# EAGLE design capMet (EAGLE 9.6.1)
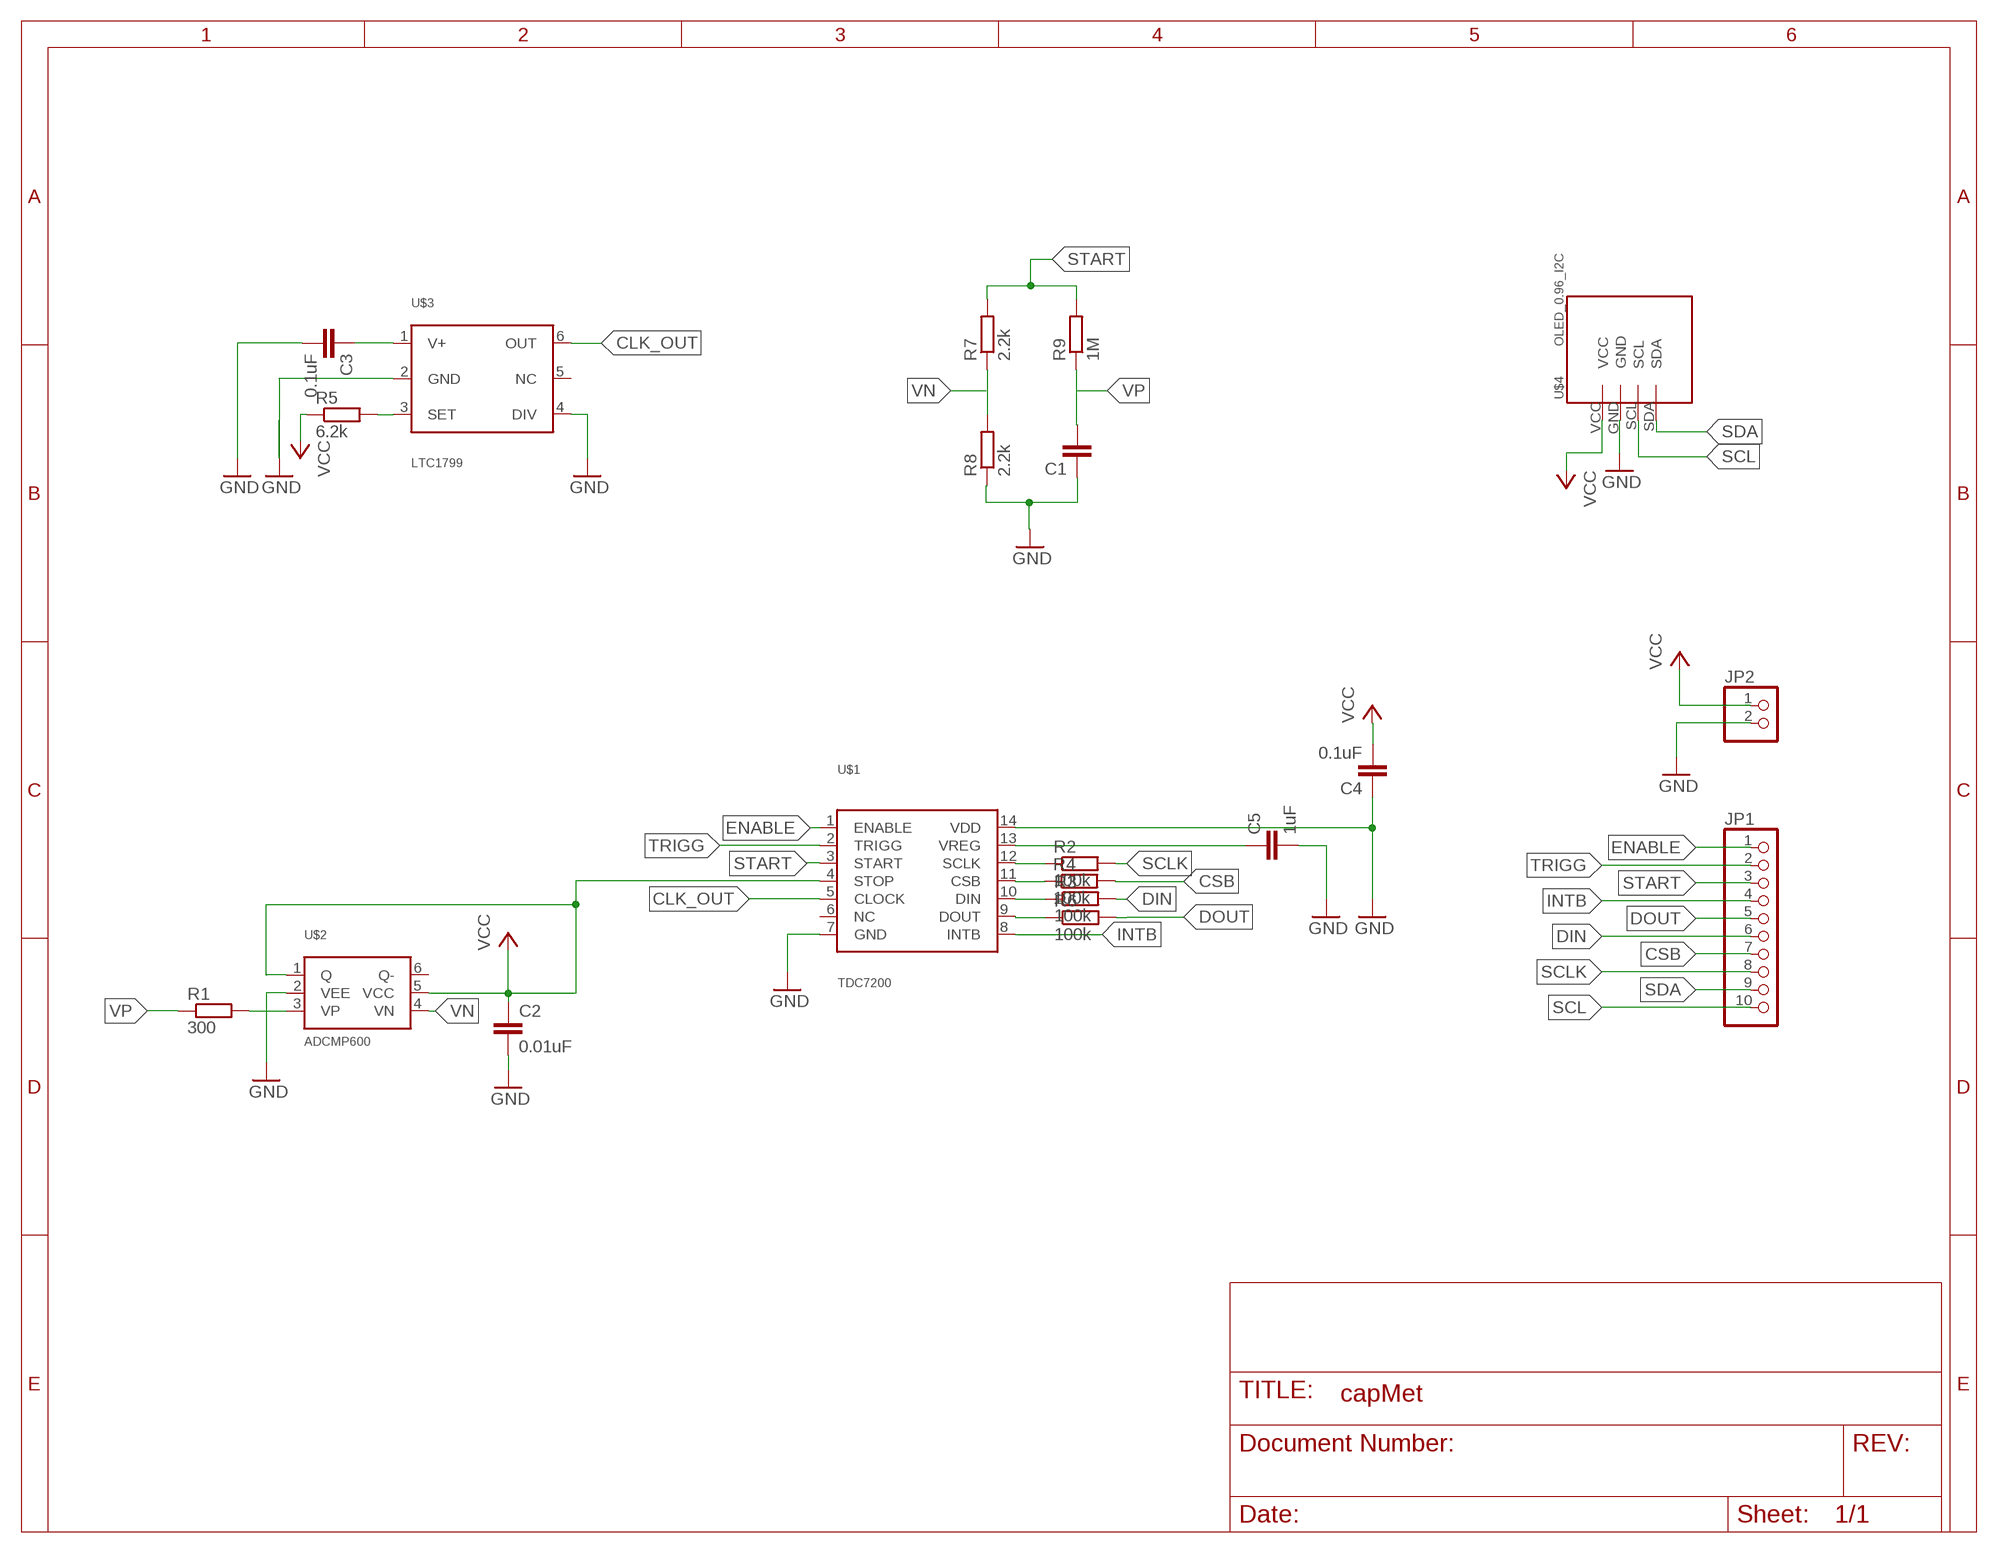
[diagram p0: schematic, sheet 1]

## Parts
C1  C-EUC0805  [C0805]
C2  0.01uF  C-EUC0805  [C0805]
C3  0.1uF  C-EUC0805  [C0805]
C4  0.1uF  C-EUC0805  [C0805]
C5  1uF  C-EUC0805  [C0805]
JP1  PINHD-1X10  [1X10]
JP2  PINHD-1X2  [1X02]
R1  300  R-EU_R0805  [R0805]
R2  100k  R-EU_R0805  [R0805]
R3  100k  R-EU_R0805  [R0805]
R4  100k  R-EU_R0805  [R0805]
R5  6.2k  R-EU_R0805  [R0805]
R6  100k  R-EU_R0805  [R0805]
R7  2.2k  R-EU_R0805  [R0805]
R8  2.2k  R-EU_R0805  [R0805]
R9  1M  R-EU_R0805  [R0805]
U$1  TDC7200  [TSSOP14]
U$2  ADCMP600  [SC70-6]
U$3  LTC1799  [TSOT23-6]
U$4  OLED_0.96_I2C  [OLED_0.96_I2C]

## Nets
CLK_OUT: U$3.6(OUT)
CSB: JP1.7 R4.2
DIN: JP1.6 R3.2
DOUT: JP1.5 R6.2
ENABLE: JP1.1 U$1.1(ENABLE)
GND: C1.1 C2.2 C3.2 C5.2 JP2.2 R8.1 U$1.7(GND) U$2.2(VEE) U$3.2(GND) U$3.4(DIV) U$4.GND
INTB: JP1.4 U$1.8(INTB)
N$1: C3.1 U$3.1(V+)
N$2: R5.2 U$3.3(SET)
N$3: U$1.5(CLOCK)
N$6: R1.2 U$2.3(VP)
N$7: U$1.4(STOP) U$2.1(Q)
N$8: R6.1 U$1.9(DOUT)
N$9: U$1.10(DIN)
N$10: U$1.11(CSB)
N$11: U$1.12(SCLK)
N$12: C5.1 U$1.13(VREG)
N$13: C4.1 U$1.14(VDD)
N$14: R7.1 R8.2
N$15: C1.2 R9.1
SCL: JP1.10 U$4.SCL
SCLK: JP1.8 R2.2
SDA: JP1.9 U$4.SDA
START: JP1.3 R7.2 R9.2 U$1.3(START)
TRIGG: JP1.2 U$1.2(TRIGG)
VCC: C2.1 C4.2 JP2.1 R5.1 U$2.5(VCC) U$4.VCC
VN: U$2.4(VN)
VP: R1.1
Unconnected: R2.1 R3.1 R4.1 U$1.6(NC) U$2.6(Q-) U$3.5(NC)

## Library data of the parts
C1-C5 = rcl:C-EU: CAPACITOR, European symbol; SPICEPREFIX: C
JP1 = pinhead:PINHD-1X10: PIN HEADER
JP2 = pinhead:PINHD-1X2: PIN HEADER
R1-R9 = rcl:R-EU_: RESISTOR, European symbol; SPICEPREFIX: R
U$1 = TDC7200:TDC7200
U$2 = ADCMP600:ADCMP600
U$3 = LTC1799:LTC1799
U$4 = tft_1.8_1.44_oled_0.96:OLED_0.96_I2C

## Board
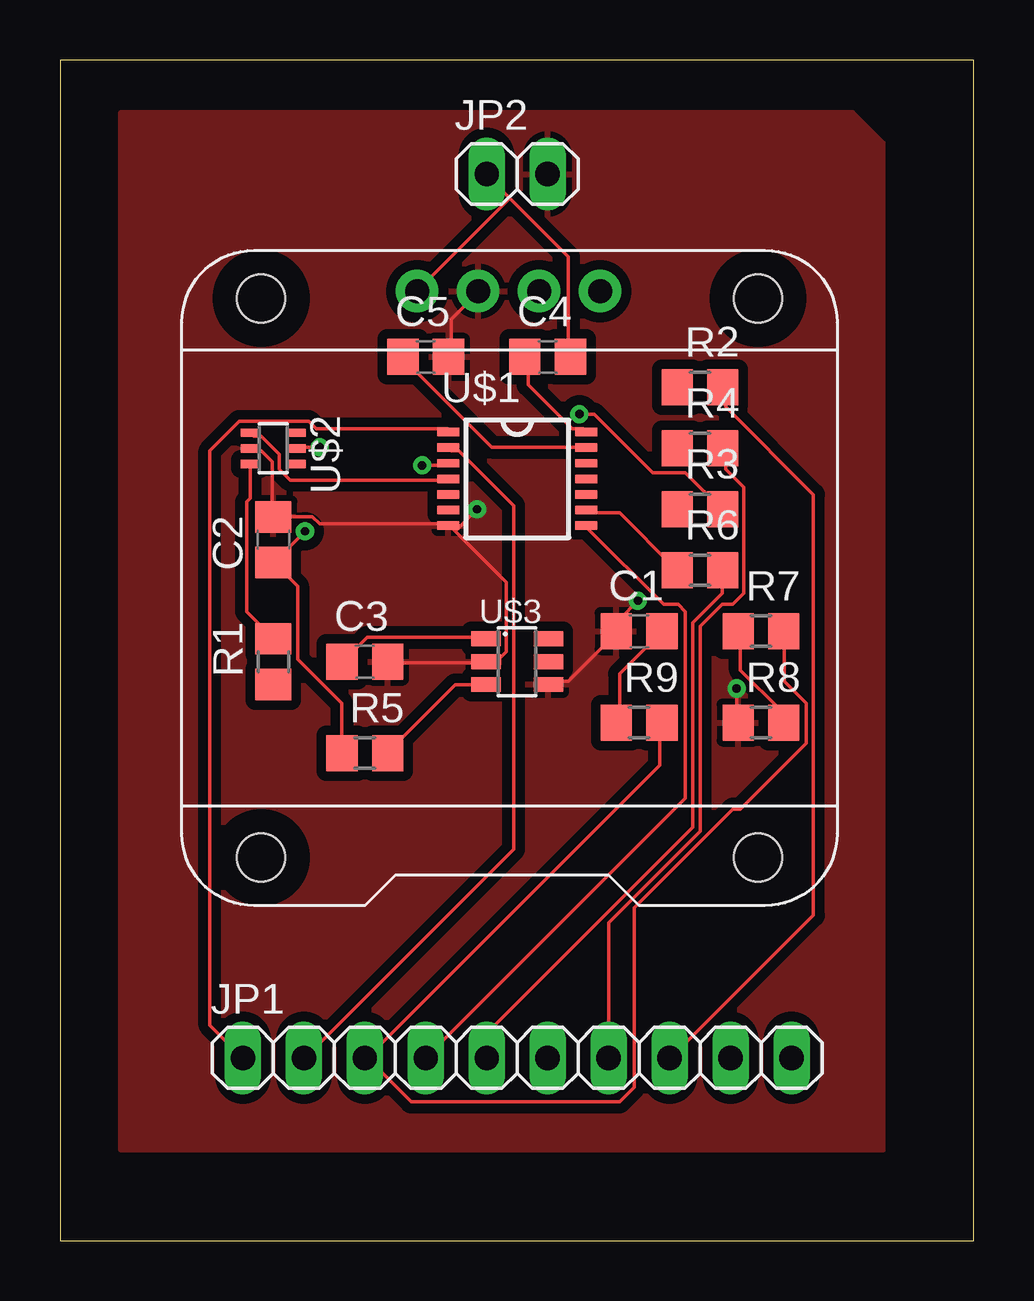
[diagram p1: board, top side]
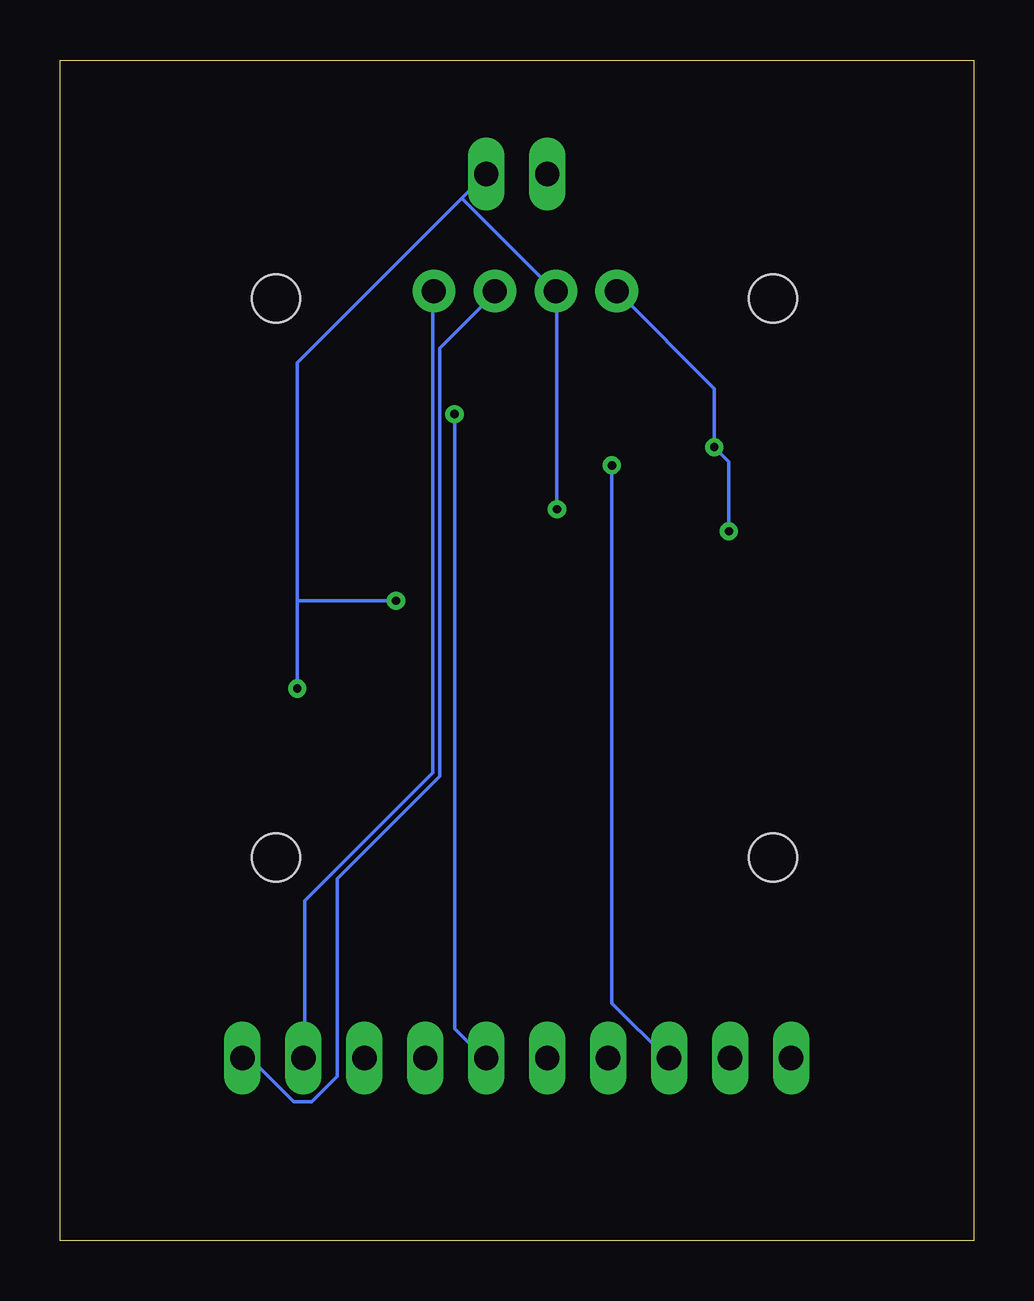
[diagram p2: board, bottom side, seen from below]

Size 38.08 x 49.2 mm. Coordinates in mm from the lower left corner, seen from the top.
Outline: 0,0 38.08,0 38.08,49.2 0,49.2 0,0
Copper layers (1*16): Top 0.035mm / dielectric 1.5mm / Bottom 0.035mm
Design rules "default": minimum track width 6mil, minimum drill 0.35mm, track to track 6mil, track to pad 6mil, pad to pad 6mil, via to via 6mil, smd to smd 6mil, copper to edge 40mil, drill to drill 6mil, minimum pad ring 10mil, minimum via ring 8mil, stop-mask expansion 4mil, vias tented up to drill 0mil, thermal gap 10mil

### Footprints (pad centres in the part's own frame; a part is rotated, then mirrored left to right if it is on the bottom)
C0805 = smd 1.3 x 1.5: 1 -0.95,0; 2 0.95,0
1X10 = drill 1.016 long: 1 -11.43,0; 2 -8.89,0; 3 -6.35,0; 4 -3.81,0; 5 -1.27,0; 6 1.27,0; 7 3.81,0; 8 6.35,0; 9 8.89,0; 10 11.43,0
1X02 = drill 1.016 long: 1 -1.27,0; 2 1.27,0
R0805 = smd 1.3 x 1.5: 1 -0.95,0; 2 0.95,0
TSSOP14 = smd 0.9 x 0.35: 1 -2.875,1.95; 2 -2.875,1.3; 3 -2.875,0.65; 4 -2.875,0; 5 -2.875,-0.65; 6 -2.875,-1.3; 7 -2.875,-1.95; 8 2.875,-1.95; 9 2.875,-1.3; 10 2.875,-0.65; 11 2.875,0; 12 2.875,0.65; 13 2.875,1.3; 14 2.875,1.95
SC70-6 = smd 0.35 x 0.8: 1 -0.65,-0.95; 2 0,-0.95; 3 0.65,-0.95; 4 0.65,0.95; 5 0,0.95; 6 -0.65,0.95
TSOT23-6 = smd 0.62 x 1.22: 1 -0.95,-1.3; 2 0,-1.3; 3 0.95,-1.3; 4 0.95,1.3; 5 0,1.3; 6 -0.95,1.3
OLED_0.96_I2C = drill 1 pad 1.778: GND -1.63,11.63; SCL 0.91,11.63; SDA 3.45,11.63; VCC -4.17,11.63 | hole 2: -10.67,-11.97; 10.03,-11.97; 10.03,11.33; -10.67,11.33

### Placement (x,y rotation side)
C1  24.13,25.4 0 top
C2  8.89,29.21 90 top
C3  12.7,24.13 0 top
C4  20.32,36.83 0 top
C5  15.24,36.83 0 top
JP1  19.05,7.62 0 top
JP2  19.05,44.45 0 top
R1  8.89,24.13 90 top
R2  26.67,35.56 0 top
R3  26.67,30.48 0 top
R4  26.67,33.02 0 top
R5  12.7,20.32 0 top
R6  26.67,27.94 0 top
R7  29.21,25.4 0 top
R8  29.21,21.59 0 top
R9  24.13,21.59 0 top
U$1  19.05,31.75 0 top
U$2  8.89,33.02 270 top
U$3  19.05,24.13 270 top
U$4  19.05,27.94 0 top

### Tracks (layer width: path | path; a pad name or v marks a point on that pad's centre or on a via)
CSB
  Top 0.152: JP1.7 22.86,13.26 26.67,17.07 26.67,25.6 27.58,26.52 28.04,26.52 28.5,26.98 28.5,31.39 27.74,32.16 27.74,32.92 R4.2
DIN  (via drill 0.35)
  Top 0.152: v21.64,34.44 22.25,34.44 24.69,32 26.06,32 27.58,30.48 R3.2
  Bottom 0.152: v21.64,34.44 21.64,8.84 20.42,7.62 JP1.6
DOUT
  Top 0.152: R6.2 27.58,27.89 27.58,26.98 26.36,25.76 26.36,17.22 17.83,8.69 17.83,7.62 JP1.5
ENABLE
  Top 0.152: JP1.1 6.25,8.99 6.25,32.92 7.47,34.14 10.36,34.14 10.67,33.83 16.15,33.83 U$1.1
GND  (via drill 0.35)
  Top 0.152: C3.2 13.72,24.08 17.68,24.08 U$3.2 17.83,24.23 18.29,24.23 18.59,24.54 18.59,27.43 16.46,29.57 | U$2.2 8.08,32.92 8.38,32.92 8.84,32.46 8.84,30.18 C2.2 8.99,30.18 10.52,30.18 10.82,29.87 16.15,29.87 U$1.7 16.31,29.72 16.46,29.57 | C5.2 16.31,36.88 16.31,38.41 17.37,39.47 U$4.GND | U$3.4 20.42,23.32 21.18,23.32 23.16,25.3 C1.1 23.32,25.45 23.32,25.91 v24.08,26.67 | v28.19,23.01 28.19,21.64 R8.1 | v17.37,30.48 16.46,29.57
  Bottom 0.152: 28.19,26.67 28.19,36.58 21.34,43.43 | 28.19,26.67 v28.19,23.01 | JP2.2 21.34,43.43 | 28.19,26.67 v24.08,26.67 | 21.34,43.43 17.53,39.62 U$4.GND 17.37,39.47 v17.37,30.48
  pour Top (isolate 0.406): 2.54,45.72 2.54,3.81 34.29,3.81 34.29,45.72 33.02,46.99 2.54,46.99
INTB
  Top 0.152: JP1.4 26.06,18.44 26.06,26.21 25.76,26.52 25.15,26.52 21.95,29.72 U$1.8
N$1
  Top 0.152: U$3.1 17.68,25.15 12.8,25.15 11.89,24.23 C3.1
N$2
  Top 0.152: U$3.3 17.68,23.16 16.46,23.16 13.72,20.42 R5.2
N$6
  Top 0.152: U$2.3 7.92,32.31 7.92,30.94 7.77,30.79 7.77,26.21 8.84,25.15 R1.2
N$7
  Top 0.152: U$2.1 8.08,33.53 8.38,33.53 9.14,32.77 9.14,32.16 9.6,31.7 16.15,31.7 U$1.4
N$8
  Top 0.152: U$1.9 21.95,30.33 23.32,30.33 25.6,28.04 R6.1
N$12
  Top 0.152: U$1.13 21.79,33.07 17.98,33.07 14.33,36.73 C5.1
N$13
  Top 0.152: U$1.14 21.79,33.83 21.34,33.83 19.51,35.66 19.51,36.73 C4.1
N$14
  Top 0.152: R7.1 28.35,25.3 28.35,23.77 30.02,22.1 30.02,21.64 R8.2
N$15
  Top 0.152: R9.1 23.32,21.64 23.32,23.62 24.99,25.3 C1.2
SCL
  Bottom 0.152: JP1.10 30.18,7.62 28.35,5.79 27.58,5.79 26.52,6.86 26.52,15.09 22.25,19.36 22.25,37.19 19.96,39.47 U$4.SCL
SCLK
  Top 0.152: R2.2 27.74,35.51 27.74,34.75 31.39,31.09 31.39,13.56 25.45,7.62 JP1.8
SDA
  Bottom 0.152: JP1.9 27.89,7.62 27.89,14.17 22.55,19.51 22.55,39.47 U$4.SDA
START  (via drill 0.35)
  Top 0.152: v15.09,32.31 16.15,32.31 U$1.3 | 12.8,7.62 24.99,19.81 24.99,21.49 R9.2 | 12.8,7.62 14.63,5.79 23.32,5.79 23.93,6.4 23.93,13.87 28.04,17.98 28.35,17.98 31.09,20.73 31.09,22.4 30.18,23.32 30.18,25.3 R7.2 | 12.8,7.62 JP1.3
  Bottom 0.152: v15.09,32.31 15.09,9.91 12.8,7.62 JP1.3
TRIGG
  Top 0.152: U$1.2 16.31,32.92 16.61,32.92 18.9,30.63 18.9,16.31 10.21,7.62 JP1.2
VCC  (via drill 0.35)
  Top 0.152: 18.75,43.43 17.83,44.35 JP2.1 | 18.75,43.43 21.18,41 21.18,36.88 C4.2 | R5.1 11.73,20.42 11.73,22.4 9.91,24.23 9.91,27.28 8.99,28.19 C2.1 8.99,28.35 v10.21,29.57 | v10.82,33.07 9.91,33.07 U$2.5 | 18.75,43.43 14.94,39.62 U$4.VCC
  Bottom 0.152: U$4.VCC 14.78,39.47 10.82,35.51 v10.82,33.07 10.21,32.46 v10.21,29.57